# Altium schematic sheet mix_txmix.SchDoc: mcHF Pro Transceiver Mixer board
size A3; Author: Krassi Atanassov; CompanyName: MØNKA; Engineer: For radio amateurs experimentation, non-commercial use only. Thank you!; Revision: 0.8.6; SheetTotal: 6
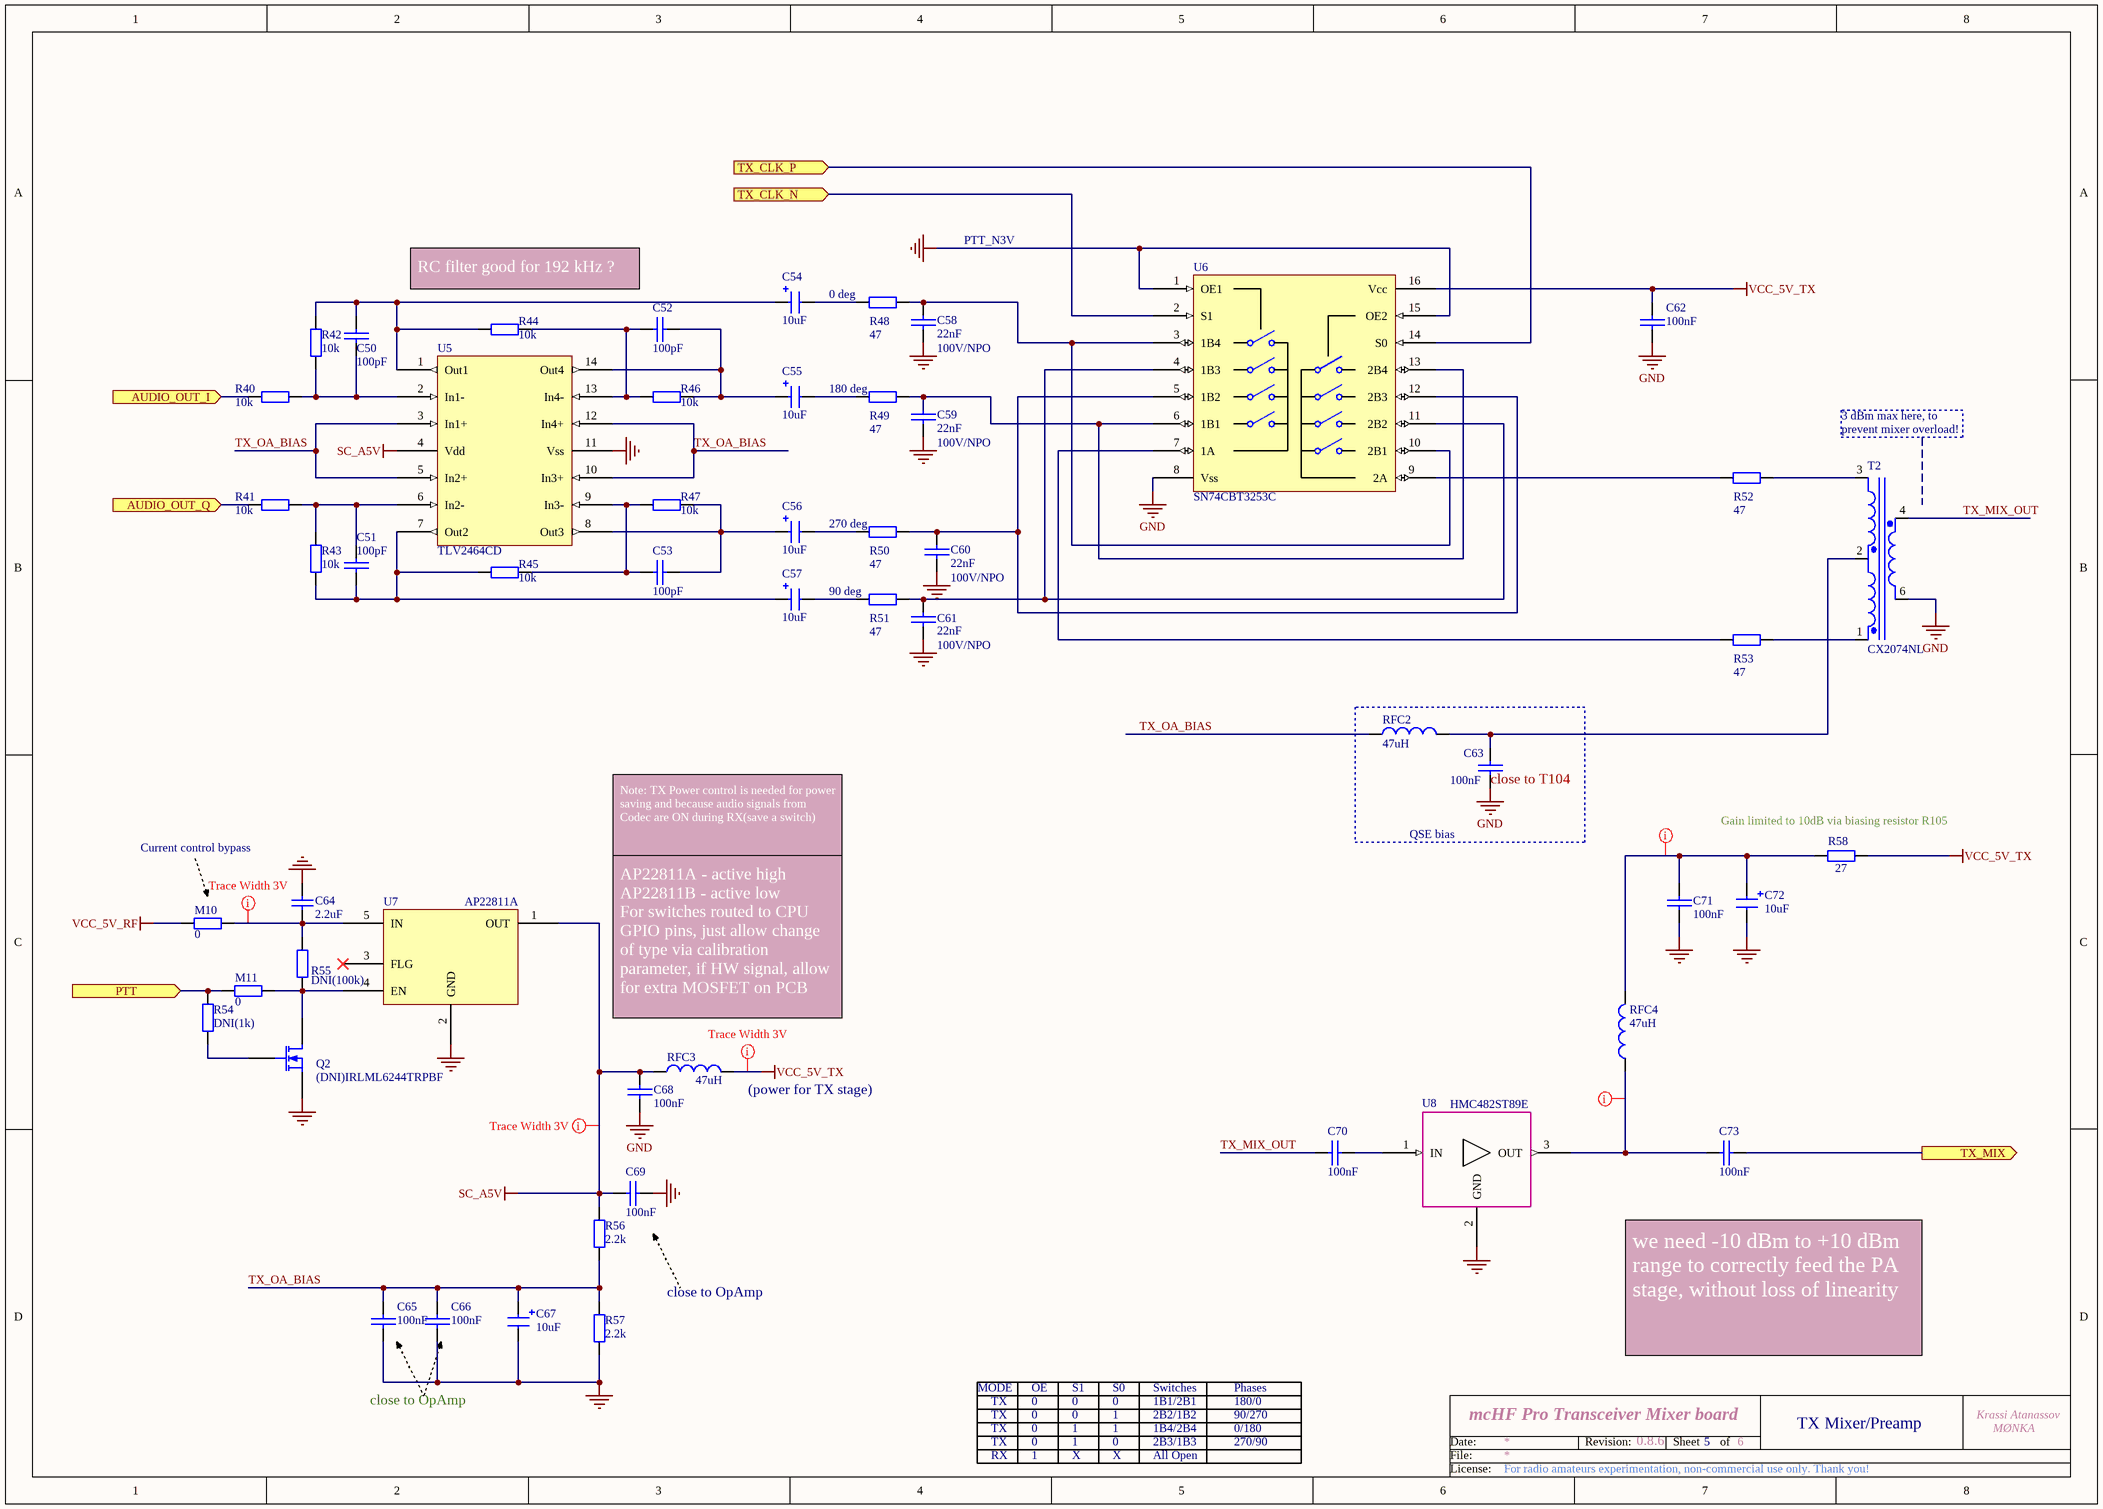
[diagram p0: mix_txmix.SchDoc]

## Parts
C50  100pF  [0805]
C51  100pF  [0805]
C52  100pF  [0805]
C53  100pF  [0805]
C54  10uF  [1206_Elec_Cap]
C55  10uF  [1206_Elec_Cap]
C56  10uF  [1206_Elec_Cap]
C57  10uF  [1206_Elec_Cap]
C58  22nF  Voltage: 100V/NPO  [CAP_B]
C59  22nF  Voltage: 100V/NPO  [CAP_B]
C60  22nF  Voltage: 100V/NPO  [CAP_B]
C61  22nF  Voltage: 100V/NPO  [CAP_B]
C62  100nF  [0805]
C63  100nF  [0805]
C64  2.2uF  [0805]
C65  100nF  [0805]
C66  100nF  [0805]
C67  10uF  [1206_Elec_Cap]
C68  100nF  [0805]
C69  100nF  [0805]
C70  100nF  [0805]
C71  100nF  [0805]
C72  10uF  [1206_Elec_Cap]
C73  100nF  [0805]
M10  0  [0805]
M11  0  [0805]
Q2  (DNI)IRLML6244TRPBF  [SOT-23]  (no BOM)
R40  10k  [0805]
R41  10k  [0805]
R42  10k  [0805]
R43  10k  [0805]
R44  10k  [0805]
R45  10k  [0805]
R46  10k  [0805]
R47  10k  [0805]
R48  47  [0805]
R49  47  [0805]
R50  47  [0805]
R51  47  [0805]
R52  47  [0805]
R53  47  [0805]
R54  DNI(1k)  [0805]  (no BOM)
R55  DNI(100k)  [0805]  (no BOM)
R56  2.2k  [0805]
R57  2.2k  [0805]
R58  27  [1206]
RFC2  47uH  [0805]
RFC3  47uH  [0805]
RFC4  47uH  [0805]
T2  CX2074NL  [SOP5_NEW1]
U5  TLV2464CD  [SO-14-Pro]
U6  SN74CBT3253C  [SO-16-Pro]
U7  AP22811A  [SOT25-5]
U8  HMC482ST89E  [SOT89L_new]

## Blocks framed on the sheet
close to T104: C63 RFC2

## Ports
AUDIO_OUT_I (in), AUDIO_OUT_Q (in), PTT (in), TX_CLK_N (in), TX_CLK_P (in), TX_MIX (out)

## Nets
GND: C58.2 C59.2 C60.2 C61.2 C62.1 C63.1 C64.1 C65.1 C66.1 C67.2 C68.1 C69.1 C71.2 C72.2 Q2.2(S) R57.1 T2.6(Pri+) U5.11(Vss) U6.1(OE1) U6.8(Vss) U6.15(OE2) U7.2(GND) U8.2(GND)
SC_A5V: C68.2 C69.2 R56.2 RFC3.1 U5.4(Vdd) U7.1(OUT)
VCC_5V_RF: M10.1
VCC_5V_TX: C62.2 R58.1 RFC3.2 U6.16(Vcc)
AUDIO_OUT_I: R40.1 ; port AUDIO_OUT_I
AUDIO_OUT_Q: R41.1 ; port AUDIO_OUT_Q
PTT: M11.2 R54.2 ; port PTT
TX_CLK_N: U6.2(S1) ; port TX_CLK_N
TX_CLK_P: U6.14(S0) ; port TX_CLK_P
TX_MIX: C73.1 ; port TX_MIX
TX_MIX_OUT: C70.2 T2.4(Pri-)
TX_OA_BIAS: C65.2 C66.2 C67.1 R56.1 R57.2 RFC2.1 U5.3(In1+) U5.5(In2+) U5.10(In3+) U5.12(In4+)
NetC50_1: C50.1 R40.2 R42.1 U5.2(In1-)
NetC50_2: C50.2 C54.1 R42.2 R44.1 U5.1(Out1)
NetC51_1: C51.1 C57.1 R43.1 R45.1 U5.7(Out2)
NetC51_2: C51.2 R41.2 R43.2 U5.6(In2-)
NetC52_1: C52.1 C55.1 R46.2 U5.14(Out4)
NetC52_2: C52.2 R44.2 R46.1 U5.13(In4-)
NetC53_1: C53.1 C56.1 R47.2 U5.8(Out3)
NetC53_2: C53.2 R45.2 R47.1 U5.9(In3-)
NetC54_2: C54.2 R48.1
NetC55_2: C55.2 R49.1
NetC56_2: C56.2 R50.1
NetC57_2: C57.2 R51.1
NetC58_1: C58.1 R48.2 U6.3(1B4) U6.10(2B1)
NetC59_1: C59.1 R49.2 U6.6(1B1) U6.13(2B4)
NetC60_1: C60.1 R50.2 U6.5(1B2) U6.12(2B3)
NetC61_1: C61.1 R51.2 U6.4(1B3) U6.11(2B2)
NetC63_2: C63.2 RFC2.2 T2.2(SecCmn)
NetC64_2: C64.2 M10.2 R55.1 U7.5(IN)
NetC70_1: C70.1 U8.1(IN)
NetC71_1: C71.1 C72.1 R58.2 RFC4.2
NetC73_2: C73.2 RFC4.1 U8.3(OUT)
NetM11_1: M11.1 Q2.3(D) R55.2 U7.4(EN)
NetQ2_1: Q2.1(G) R54.1
NetR52_1: R52.1 U6.9(2A)
NetR52_2: R52.2 T2.3(Sec180)
NetR53_1: R53.1 U6.7(1A)
NetR53_2: R53.2 T2.1(Sec0)

Not connected (* = marked no-connect by the designer): U7 3(FLG)*

## Layout directives
rule Width Constraint [Pref Width = 12mil    Min Width = 12mil    Max Width = 12mil]: NetC64_2, NetC71_1, NetC73_2, SC_A5V, VCC_5V_TX

## Notes on the sheet
- PTT_N3V
- RC filter good for 192 kHz ?
- (near R48) 0 deg
- (near R49) 180 deg
- 3 dBm max here, to
- (near T2) prevent mixer overload!
- (near R50) 270 deg
- (near R51) 90 deg
- Current control bypass
- Note: TX Power control is needed for power saving and because audio signals from Codec are ON during RX(save a switch)
- QSE bias
- (near R58) Gain limited to 10dB via biasing resistor R105
- AP22811A - active high                                 AP22811B - active low                             For switches routed to CPU GPIO pins, just allow change of type via calibration parameter, if HW signal, allow for extra MOSFET on PCB
- (near RFC3) (power for TX stage)
- close to OpAmp
- MODE
- OE
- S1
- S0
- Switches
- Phases
- we need -10 dBm to +10 dBm range to correctly feed the PA stage, without loss of linearity
- TX
- RX
- 0
- 1
- X
- 1B1/2B1
- 2B2/1B2
- 2B3/1B3
- 1B4/2B4
- All Open
- 180/0
- 90/270
- 270/90
- 0/180
- 5
- TX Mixer/Preamp
- Date:
- File:
- Revision:
- Sheet
- of
- License:

## Library data of the parts
C50-C53 = CAP: Capacitor; Order: FN 233-2692; QT Order: QCC-00070; Price: 0.056
C54-C57 C67 C72 = CAP-POL: Electrolitic capacitor; Order: FN 233-3009; QT Order: QCC-00166; Price: 0.204
C58-C61 = CAP: Capacitor; Order: FN 221-1120; Price: 0.84
C62 C63 C65 C66 C68-C71 C73 = CAP: Capacitor; Order: FN 252-2090; QT Order: QCC-00154; Price: 0.068
C64 = CAP SMD 0603  X5R 1礔 25V 10%: 0603  X5R 1礔; Rated voltage: 25V; Tolerance: 10%; Manufacturer: *; Manufacturer P/N: *; Order code Farnell: 1288202RL; Value: 1礔; Power: *; Technology: X5R; Temperature  Factor: *; Temperature Max: +125癈; Temperature Min: -55癈; STS Code: *
M10 M11 R54 = RES: Resistor; Order: FN 933-3681; QT Order: QCR-00268; Price: 0.009
Q2 = MOSFET-N: N-Channel MOSFET; QT Order: QCT-00022; QT Price: 0.28; Order: FN 186-4517; Price: 0.231
R40-R47 = RES: Resistor; Order: FN 146-9856; QT Order: QCR-00349; Price: 0.021
R48-R53 = RES: Resistor; Order: FN 173-8942; QT Order: QCR-00293; Price: 0.052
R55 = RES: Resistor; Order: FN 157-6459; QT Order: QCR-00579; Price: 0.061
R56 R57 = RES: Resistor; Order: FN 188-7289; QT Order: QCR-00333; Price: 0.046
R58 = RES: Resistor; Order: FN 205-7802; QT Order: QCR-00427; Price: 0.017
RFC2-RFC4 = TDK-NLV25T: INDUCTOR, SIGNAL LINE, 4.7UH, 1005; Order: FN 166-9895; Price: 0.166
T2 = CX2074NL: Wideband RF Transformer 1:4; Order: DK 553-1655-ND; Price: 2.01
U5 = TLV2464CD: Low Power, Rail-To-Rail OpAmp; Order: FN 845-5171; Price: 1.47
U6 = SN74CBT3253C: Dual 4:1 Demux/Analog Switch; Order: FN 175-0447; Price: 0.69
U7 = AP22811: High-side switch; Order: FN 274-8550
U8 = HMS482ST89E: MMIC AMPLIFIER; Order: FN 245-6527; Notes: What was the Farnell replacement part for this ? Or source from Ali, as it is EOL; Price: 2.82